# Altium schematic sheet mcu.SchDoc
size A0
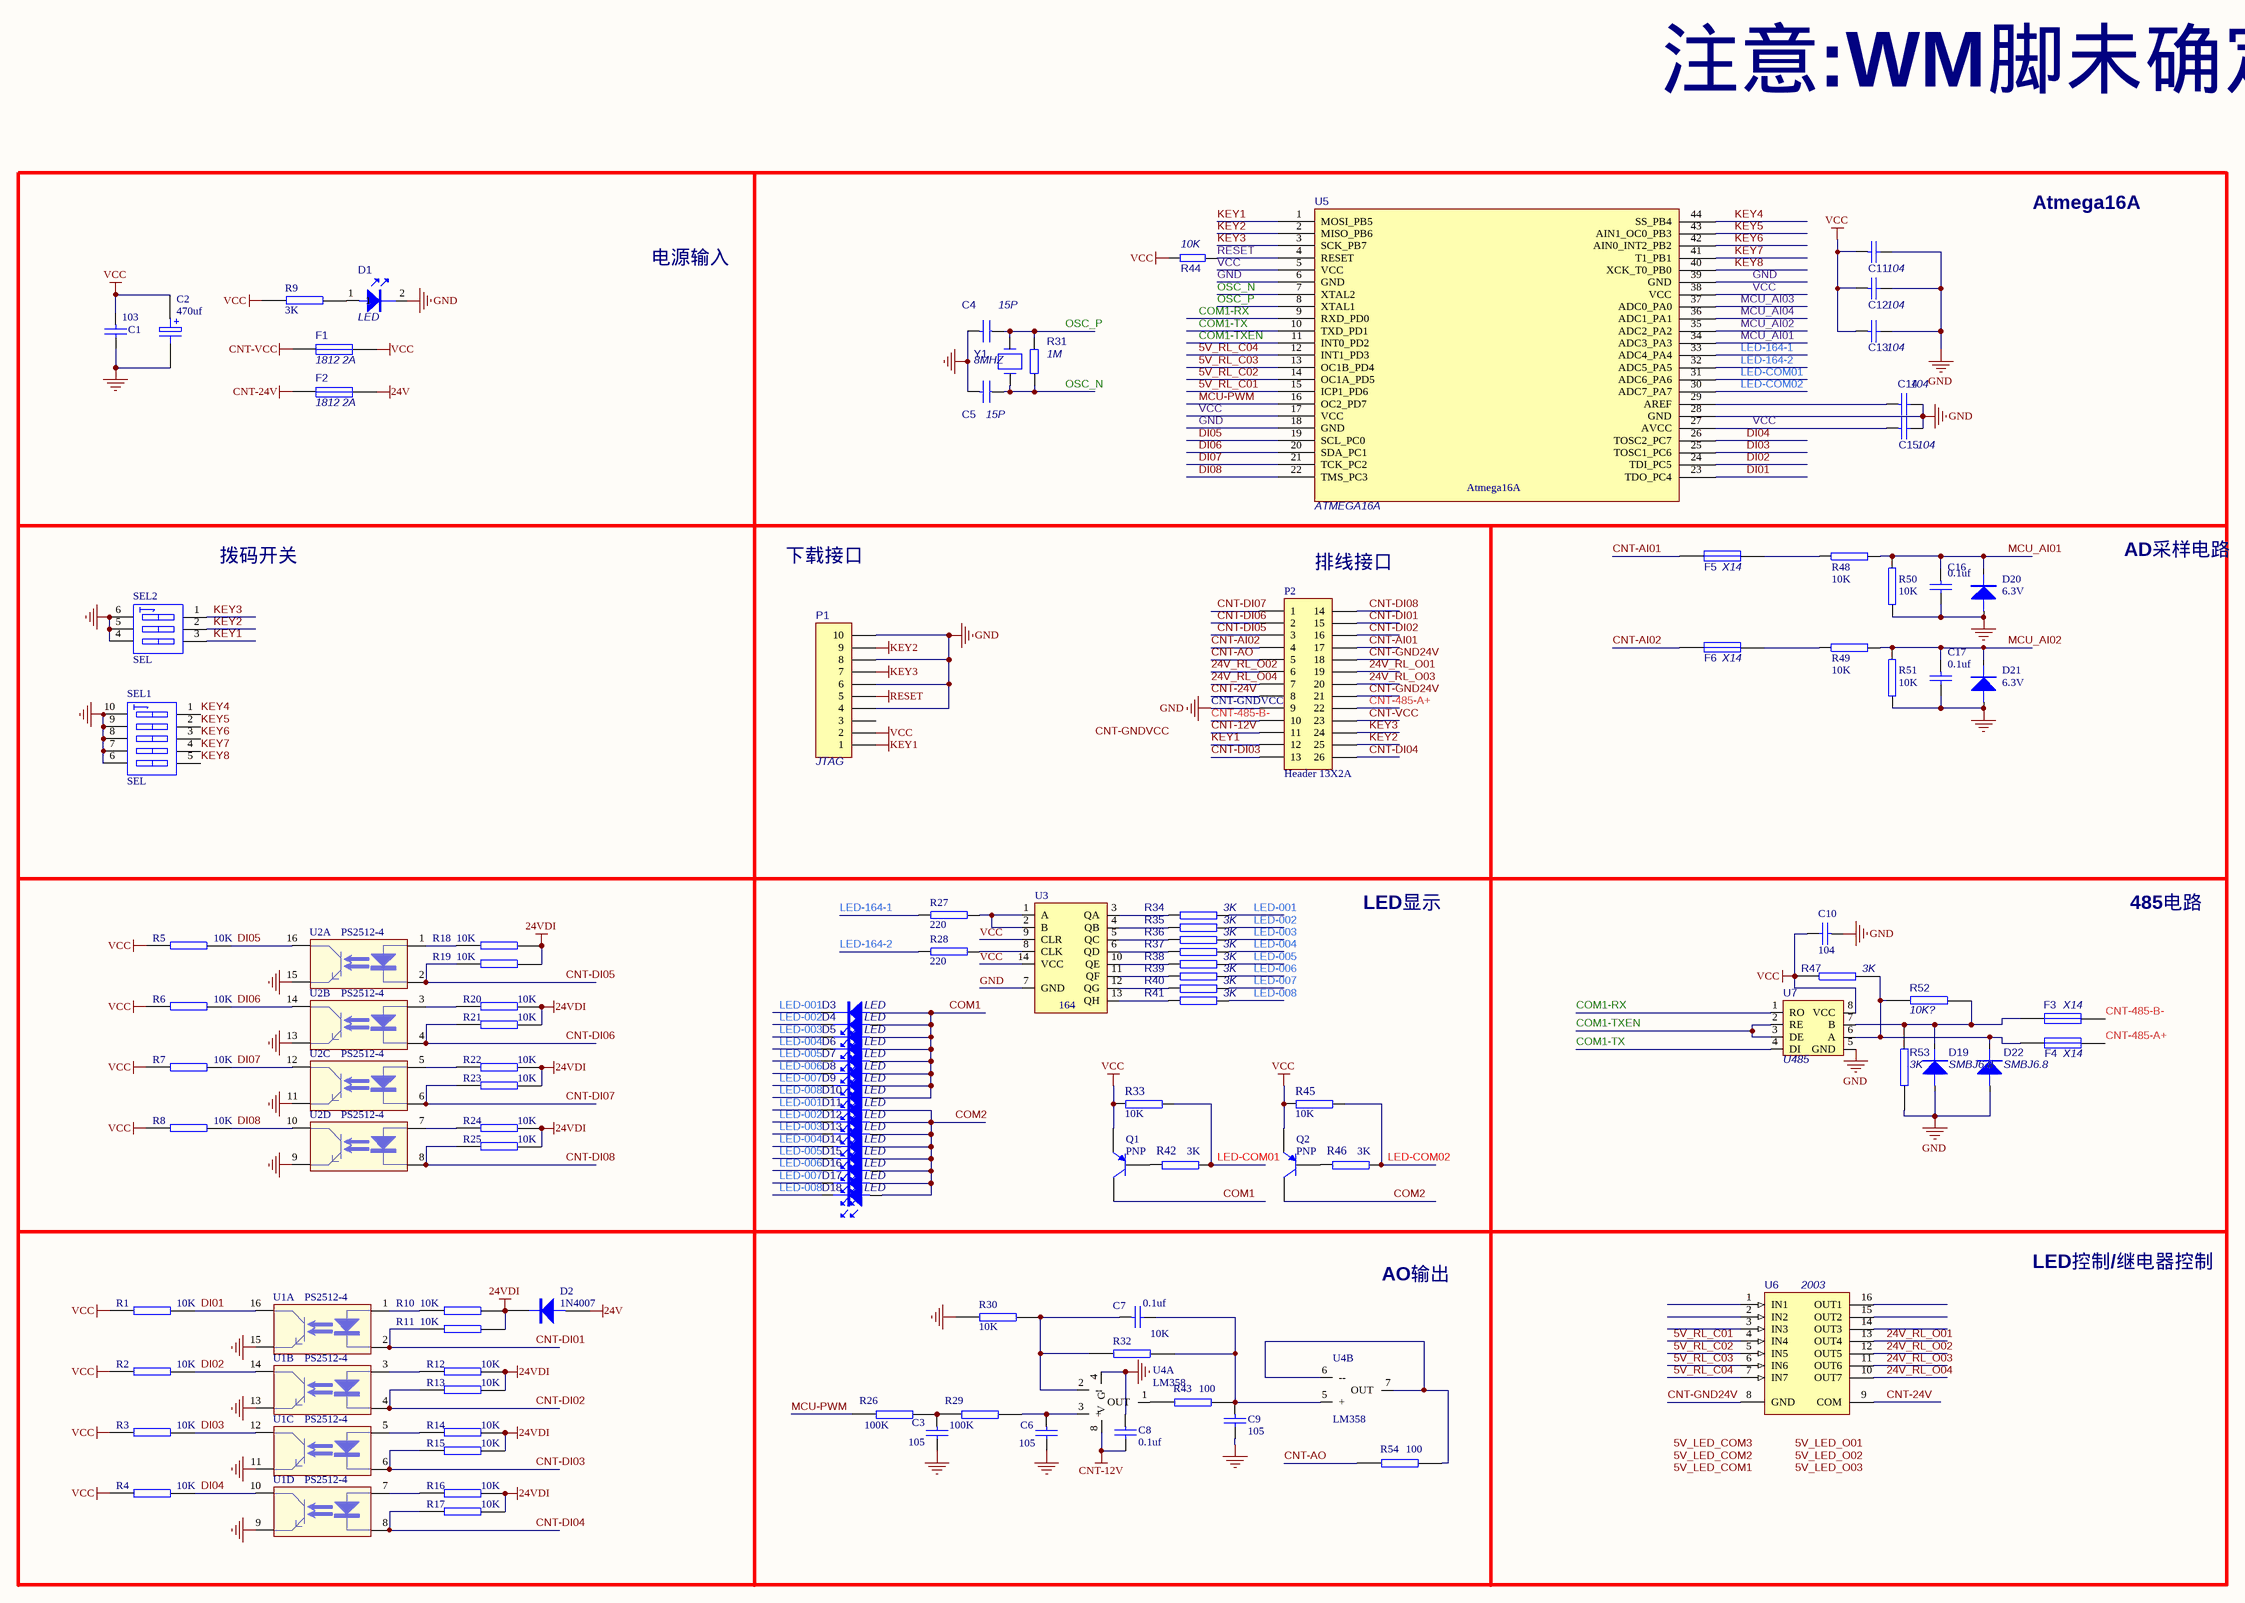
[diagram p0: mcu.SchDoc]

## Parts
C1  103  [C0805]
C2  470uf  [E8MM]
C3  105  [c0805]
C4  15P  [C0805]
C5  15P  [C0805]
C6  105  [c0805]
C7  0.1uf  [C0805]
C8  0.1uf  [C0805]
C9  105  [c0805]
C10  104  [C0805]
C11  104  [C0805]
C12  104  [C0805]
C13  104  [C0805]
C14  104  [C0805]
C15  104  [C0805]
C16  0.1uf  [C0805]
C17  0.1uf  [C0805]
D1  LED  [LED0805]
D2  1N4007  [M7]
D3  LED  [LED0805]
D4  LED  [LED0805]
D5  LED  [LED0805]
D6  LED  [LED0805]
D7  LED  [LED0805]
D8  LED  [LED0805]
D9  LED  [LED0805]
D10  LED  [LED0805]
D11  LED  [LED0805]
D12  LED  [LED0805]
D13  LED  [LED0805]
D14  LED  [LED0805]
D15  LED  [LED0805]
D16  LED  [LED0805]
D17  LED  [LED0805]
D18  LED  [LED0805]
D19  SMBJ6.8  [SMBJ_SMT]
D20  6.3V  [1206AK]
D21  6.3V  [1206AK]
D22  SMBJ6.8  [SMBJ_SMT]
F1  1812 2A  [F1210]
F2  1812 2A  [F1210]
F3  X14  [F1210]
F4  X14  [F1210]
F5  X14  [F1210]
F6  X14  [F1210]
P1  JTAG  [FC10]
P2  Header 13X2A  [HDR2X13_CEN]
Q1  PNP  [SOT23]
Q2  PNP  [SOT23]
R1  10K  [0805R]
R2  10K  [0805R]
R3  10K  [0805R]
R4  10K  [0805R]
R5  10K  [0805R]
R6  10K  [0805R]
R7  10K  [0805R]
R8  10K  [0805R]
R9  3K  [0805R]
R10  10K  [0805R]
R11  10K  [0805R]
R12  10K  [0805R]
R13  10K  [0805R]
R14  10K  [0805R]
R15  10K  [0805R]
R16  10K  [0805R]
R17  10K  [0805R]
R18  10K  [0805R]
R19  10K  [0805R]
R20  10K  [0805R]
R21  10K  [0805R]
R22  10K  [0805R]
R23  10K  [0805R]
R24  10K  [0805R]
R25  10K  [0805R]
R26  100K  [0805R]
R27  220  [0805R]
R28  220  [0805R]
R29  100K  [0805R]
R30  10K  [0805R]
R31  1M  [0805R]
R32  10K  [0805R]
R33  10K  [0805R]
R34  3K  [0805R]
R35  3K  [0805R]
R36  3K  [0805R]
R37  3K  [0805R]
R38  3K  [0805R]
R39  3K  [0805R]
R40  3K  [0805R]
R41  3K  [0805R]
R42  3K  [0805R]
R43  100  [0805R]
R44  10K  [0805R]
R45  10K  [0805R]
R46  3K  [0805R]
R47  3K  [0805R]
R48  10K  [0805R]
R49  10K  [0805R]
R50  10K  [0805R]
R51  10K  [0805R]
R52  10K?  [0805R]
R53  3K  [0805R]
R54  100  [0805R]
SEL1  SEL  [N10A]
SEL2  SEL  [DIP-6]
U1  PS2512-4  [SO_16]  (parts A,B,C,D of 4)
U2  PS2512-4  [SO_16]  (parts A,B,C,D of 4)
U3  164  [SO_14]
U4  LM358  [SO_08]  (parts A,B of 2)
U5  ATMEGA16A  [qfp44]
U6  2003  [SO_16]
U7  U485  [SOP8]
Y1  8MHZ  [XAL2]

## Blocks framed on the sheet
电源输入: C1 C2 D1 F1 F2 R9
Atmega16A: C4 C5 C11-C15 R31 R44 U5 Y1
拨码开关: SEL1 SEL2
AD采样电路: C16 C17 D20 D21 F5 F6 R48-R51
LED显示: D3-D18 Q1 Q2 R27 R28 R33-R42 R45 R46 U3
485电路: C10 D19 D22 F3 F4 R47 R52 R53 U7
AO输出: C3 C6-C9 R26 R29 R30 R32 R43 R54 U4
LED控制/继电器控制: U6

## Nets
24V: D2.1(A) F2.2
24VDI: D2.2(K) R10.1 R11.1 R12.1 R13.1 R14.1 R15.1 R16.1 R17.1 R18.1 R19.1 R20.1 R21.1 R22.1 R23.1 R24.1 R25.1
CNT-12V: C8.2 P2.11 U4.8(V)
CNT-24V: F2.1 P2.8 U6.9(COM)
CNT-VCC: F1.1 P2.23
GND: C1.2 C2.2 C3.2 C4.2 C5.2 C6.2 C8.1 C9.2 C10.1 C11.2 C12.2 C13.2 C14.2 C15.2 C16.2 C17.2 D1.2 D19.A D20.A D21.A D22.A P1.4 P1.6 P1.8 P1.10 P2.9 R30.1 R50.1 R51.1 R53.1 SEL1.6(B5) SEL1.7(B4) SEL1.8(B3) SEL1.9(B2) SEL1.10(B1) SEL2.4(B3) SEL2.5(B2) SEL2.6(B1) U1.9 U1.11 U1.13 U1.15 U2.9 U2.11 U2.13 U2.15 U3.7(GND) U4.4(G) U5.6(GND) U5.18(GND) U5.28(GND) U5.39(GND) U7.5(GND)
KEY1: P1.1 P2.12 SEL2.3(A3) U5.1(MOSI_PB5)
KEY2: P1.9 P2.25 SEL2.2(A2) U5.2(MISO_PB6)
KEY3: P1.7 P2.24 SEL2.1(A1) U5.3(SCK_PB7)
RESET: P1.5 R44.1 U5.4(RESET)
VCC: C1.1 C2.1 C10.2 C11.1 C12.1 C13.1 C15.1 F1.2 P1.2 Q1.3(E) Q2.3(E) R1.2 R2.2 R3.2 R4.2 R5.2 R6.2 R7.2 R8.2 R9.2 R33.1 R44.2 R45.1 R47.1 U3.9(CLR) U3.14(VCC) U5.5(VCC) U5.17(VCC) U5.27(AVCC) U5.38(VCC) U7.8(VCC)
5V_RL_C01: U5.15(ICP1_PD6) U6.4(IN4)
5V_RL_C02: U5.14(OC1A_PD5) U6.5(IN5)
5V_RL_C03: U5.13(OC1B_PD4) U6.6(IN6)
5V_RL_C04: U5.12(INT1_PD3) U6.7(IN7)
24V_RL_O01: P2.19 U6.13(OUT4)
24V_RL_O02: P2.6 U6.12(OUT5)
24V_RL_O03: P2.20 U6.11(OUT6)
24V_RL_O04: P2.7 U6.10(OUT7)
CNT-485-A+: F4.1 P2.22
CNT-485-B-: F3.1 P2.10
CNT-AI01: F5.2 P2.17
CNT-AI02: F6.2 P2.4
CNT-AO: P2.5 R54.1
CNT-DI01: P2.15 R11.2 U1.2
CNT-DI02: P2.16 R13.2 U1.4
CNT-DI03: P2.13 R15.2 U1.6
CNT-DI04: P2.26 R17.2 U1.8
CNT-DI05: P2.3 R19.2 U2.2
CNT-DI06: P2.2 R21.2 U2.4
CNT-DI07: P2.1 R23.2 U2.6
CNT-DI08: P2.14 R25.2 U2.8
CNT-GND24V: P2.18 P2.21 U6.8(GND)
COM1: D3.1 D4.1 D5.1 D6.1 D7.1 D8.1 D9.1 D10.1 Q1.1(C)
COM1-RX: U5.9(RXD_PD0) U7.1(RO)
COM1-TX: U5.10(TXD_PD1) U7.4(DI)
COM1-TXEN: U5.11(INT0_PD2) U7.2(RE) U7.3(DE)
COM2: D11.1 D12.1 D13.1 D14.1 D15.1 D16.1 D17.1 D18.1 Q2.1(C)
DI01: R1.1 U1.16 U5.23(TDO_PC4)
DI02: R2.1 U1.14 U5.24(TDI_PC5)
DI03: R3.1 U1.12 U5.25(TOSC1_PC6)
DI04: R4.1 U1.10 U5.26(TOSC2_PC7)
DI05: R5.1 U2.16 U5.19(SCL_PC0)
DI06: R6.1 U2.14 U5.20(SDA_PC1)
DI07: R7.1 U2.12 U5.21(TCK_PC2)
DI08: R8.1 U2.10 U5.22(TMS_PC3)
KEY4: SEL1.1(A1) U5.44(SS_PB4)
KEY5: SEL1.2(A2) U5.43(AIN1_OC0_PB3)
KEY6: SEL1.3(A3) U5.42(AIN0_INT2_PB2)
KEY7: SEL1.4(A4) U5.41(T1_PB1)
KEY8: SEL1.5(A5) U5.40(XCK_T0_PB0)
LED-001: D3.2 D11.2 R34.2
LED-002: D4.2 D12.2 R35.2
LED-003: D5.2 D13.2 R36.2
LED-004: D6.2 D14.2 R37.2
LED-005: D7.2 D15.2 R38.2
LED-006: D8.2 D16.2 R39.2
LED-007: D9.2 D17.2 R40.2
LED-008: D10.2 D18.2 R41.2
LED-164-1: R27.2 U5.33(ADC4_PA4)
LED-164-2: R28.2 U5.32(ADC5_PA5)
LED-COM01: R33.2 R42.2 U5.31(ADC6_PA6)
LED-COM02: R45.2 R46.2 U5.30(ADC7_PA7)
MCU-PWM: R26.1 U5.16(OC2_PD7)
MCU_AI01: C16.1 D20.K R48.2 R50.2 U5.34(ADC3_PA3)
MCU_AI02: C17.1 D21.K R49.2 R51.2 U5.35(ADC2_PA2)
MCU_AI03: U5.37(ADC0_PA0)
MCU_AI04: U5.36(ADC1_PA1)
OSC_N: C5.1 R31.1 U5.7(XTAL2) Y1.2
OSC_P: C4.1 R31.2 U5.8(XTAL1) Y1.1
NetC3_1: C3.1 R26.2 R29.1
NetC6_1: C6.1 R29.2 U4.3(+)
NetC7_1: C7.1 R30.2 R32.1 U4.2(--)
NetC7_2: C7.2 C9.1 R32.2 R43.2 U4.5(+)
NetC14_1: C14.1 U5.29(AREF)
NetD1_1: D1.1 R9.1
NetD19_K: D19.K F3.2 R52.1 R53.2 U7.7(B)
NetD22_K: D22.K F4.2 R47.2 R52.2 U7.6(A)
NetF5_1: F5.1 R48.1
NetF6_1: F6.1 R49.1
NetQ1_2: Q1.2(B) R42.1
NetQ2_2: Q2.2(B) R46.1
NetR10_2: R10.2 U1.1
NetR12_2: R12.2 U1.3
NetR14_2: R14.2 U1.5
NetR16_2: R16.2 U1.7
NetR18_2: R18.2 U2.1
NetR20_2: R20.2 U2.3
NetR22_2: R22.2 U2.5
NetR24_2: R24.2 U2.7
NetR27_1: R27.1 U3.1(A) U3.2(B)
NetR28_1: R28.1 U3.8(CLK)
NetR34_1: R34.1 U3.3(QA)
NetR35_1: R35.1 U3.4(QB)
NetR36_1: R36.1 U3.5(QC)
NetR37_1: R37.1 U3.6(QD)
NetR38_1: R38.1 U3.10(QE)
NetR39_1: R39.1 U3.11(QF)
NetR40_1: R40.1 U3.12(QG)
NetR41_1: R41.1 U3.13(QH)
NetR43_1: R43.1 U4.1(OUT)
NetR54_2: R54.2 U4.6(--) U4.7(OUT)

Not connected (* = marked no-connect by the designer): P1 3; U6 1(IN1) 2(IN2) 3(IN3) 14(OUT3) 15(OUT2) 16(OUT1)

## Notes on the sheet
- 注意:WM脚未确定位置
- 下载接口
- (near P2) 排线接口
- (near P2) CNT-GNDVCC
- Labels drawn without touching a wire or pin: 5V_LED_COM1, 5V_LED_COM2, 5V_LED_COM3, 5V_LED_O01, 5V_LED_O02, 5V_LED_O03, CNT-GNDVCC
- (in symbol ATMEGA16A) Atmega16A

## Library data of the parts
C1 C11-C17 = CAP: Capacitor; 采购信息: 0.1uF X7R,5%,50V,贴片电容
C2 = ELECTRO1: Electrolytic Capacitor
C3 C6 C9 = CAP: Capacitor; 采购信息: 1uF 25V X7R,5%,50V,贴片电容 0805
C4 C5 = CAP NP
C7 C8 = CAP: Capacitor; 采购信息: X7R,5%,50V,贴片电容
C10 = CAP: Capacitor; 采购信息: 0.1uF 25V X7R,5%,50V,贴片电容 0805
D2 D19 D22 = DIODE
D20 D21 = DIODE: 采购信息: SMB封装 6.8V SMBJ6.8CA
F1-F6 = Fuse 1: Fuse; Published: 8-Jun-2000; LatestRevisionDate: 17-Jul-2002; LatestRevisionNote: Re-released for DXP Platform.; PackageReference: PIN-W2/E2.8; Publisher: Altium Limited
P1 = CON10: Connector
P2 = Header 13X2A: Header, 13-Pin, Dual row; LatestRevisionDate: 17-Jul-2002; LatestRevisionNote: Re-released for DXP Platform.; Publisher: Altium Limited
Q1 Q2 = PNP: PNP Bipolar Transistor; Published: 8-Jun-2000; LatestRevisionDate: 17-Jul-2002; LatestRevisionNote: Re-released for DXP Platform.; PackageReference: SOT-23B; Publisher: Altium Limited; Code_JEDEC: SOT-23
R1-R8 R10-R25 = RES2: 采购信息: 1K.1%,0.25W
R9 R27 R28 R33-R42 R45-R47 R52 R53 = RES2
R26 R29 = RES2: 采购信息: 100K,1%,0.25W
R30 R32 R48-R51 = RES2: 采购信息: 10K.1%,0.25W
R31 R44 = res
R43 R54 = RES2: 采购信息: 100,5%,0.25W
SEL1 = SW DIP-5: DIP Switch, 5 Position, SPST; Published: 24-Mar-1999; LatestRevisionDate: 17-Jul-2002; LatestRevisionNote: Re-released for DXP Platform.; PackageReference: N10A; Publisher: Altium Limited
SEL2 = SW DIP-3: DIP Switch, 3 Position, SPST; Published: 24-Mar-1999; LatestRevisionDate: 17-Jul-2002; LatestRevisionNote: Re-released for DXP Platform.; PackageReference: DIP-6; Publisher: Altium Limited; Code_JEDEC: MO-001-AM
U4 = LM358: 采购信息: 贴片 LM358
U6 = ULN2003A: High-Voltage, High-Current Darlington Array; 采购信息: ULN2003 台产 贴片; Published: *; LatestRevisionDate: *; LatestRevisionNote: *; DatasheetVersion: *; PackageVersion: *; PackageReference: *; Publisher: *; PackageDescription: *; Code_JEDEC: *; ComponentLink1Description: *; ComponentLink1URL: *
Y1 = CRYSTAL